# Altium schematic sheet CTRL.SchDoc
size 431 x 279 mm; MPS_ProjectReference: B005; MPS_ProjectName: 230W E-Bike Charger; MPS_Enginieer: Oriol Cos; MPS_Drawn by: -; MPS_Review: v1.2; MPS_SheetNumber: 4; MPS_SheetTotal: 4; MPS_Designed For: Public Reference Design; MPS_Contact: www.monolithicpower.com; Organization: ORGANIZATION; Address1: ADDRESS 1; Address2: ADDRESS 2; Address3: ADDRESS 3; Address4: ADDRESS 4; Revision: -; ENG_APP_DATE: --/--/--; DSN_APP_DATE: --/--/--; CHK_APP_DATE: --/--/--
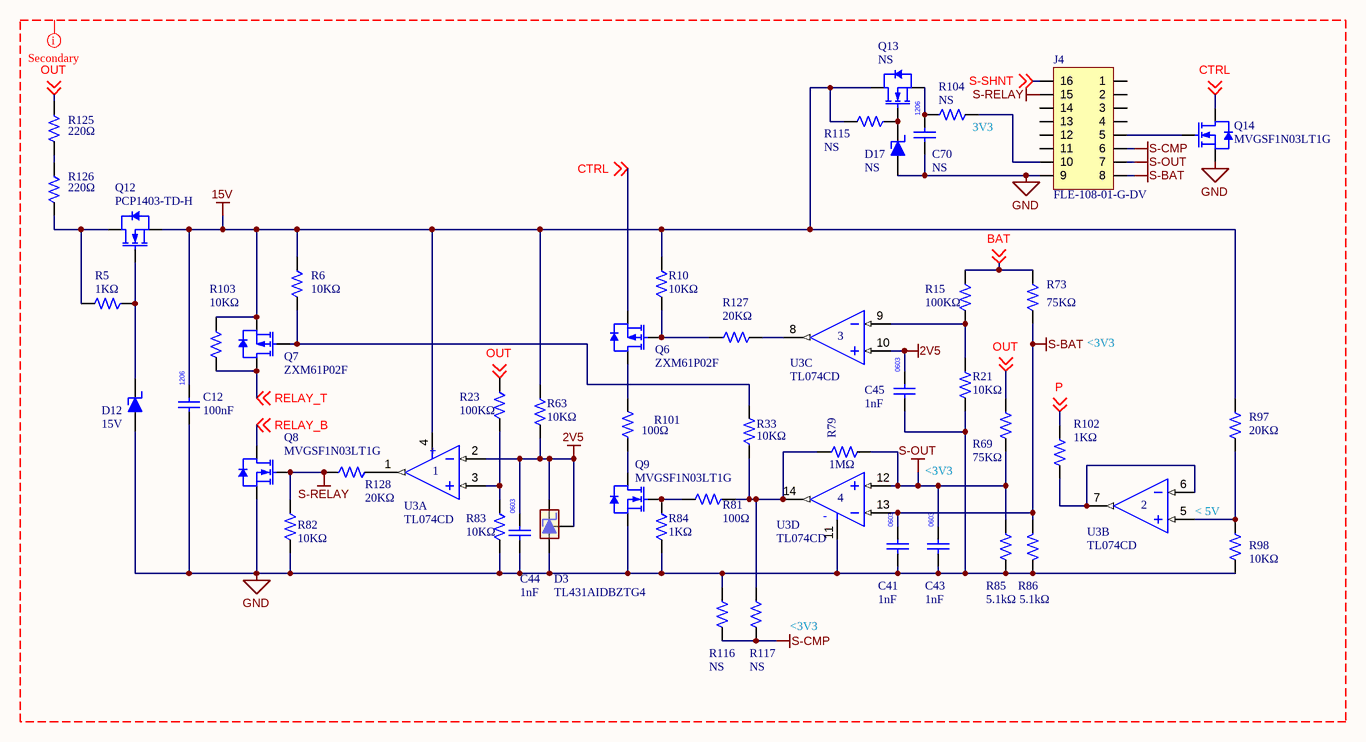
[diagram p0: CTRL.SchDoc]

## Parts
C12  value 100nF  [CC/NM 1206]
C41  value 1nF  [CC/NM 0603]
C43  value 1nF  [CC/NM 0603]
C44  value 1nF  [CC/NM 0603]
C45  value 1nF  [CC/NM 0603]
C70  value NS  [CC/NM 1206]
D3  TL431AIDBZTG4  [SOT95P237X112-3N]
D12  value 15V  [SOT95P237X112-3N]
D17  value NS  [SOT95P237X112-3N]
J4  FLE-108-01-G-DV  [FLE-108-01-G-DV]
Q6  ZXM61P02F  [SOT95P237X112-3N]
Q7  ZXM61P02F  [SOT95P237X112-3N]
Q8  MVGSF1N03LT1G  [SOT95P237X112-3N]
Q9  MVGSF1N03LT1G  [SOT95P237X112-3N]
Q12  PCP1403-TD-H  [SOT89/4]
Q13  Manufacturer Part Number 1: NS  [SOT89/4]  (hidden comment: PCP1403-TD-H)
Q14  MVGSF1N03LT1G  [SOT95P237X112-3N]
R5  value 1KΩ  [CC/NM 0603]
R6  value 10KΩ  [CC/NM 0603]
R10  value 10KΩ  [CC/NM 0603]
R15  value 100KΩ  [CC/NM 0603]  (hidden comment: Resistor 100K)
R21  value 10KΩ  [CC/NM 0603]
R23  value 100KΩ  [CC/NM 0603]  (hidden comment: Resistor 100K)
R33  value 10KΩ  [CC/NM 0603]  (hidden comment: Resistor 100)
R63  value 10KΩ  [CC/NM 0603]
R69  value 75KΩ  [CC/NM 0603]  (hidden comment: Resistor 150K)
R73  value 75KΩ  [CC/NM 0603]  (hidden comment: Resistor 150K)
R79  value 1MΩ  [CC/NM 0603]  (hidden comment: Resistor 150K)
R81  value 100Ω  [CC/NM 0603]  (hidden comment: Resistor 100)
R82  value 10KΩ  [CC/NM 0603]
R83  value 10KΩ  [CC/NM 0603]
R84  value 1KΩ  [CC/NM 0603]
R85  value 5.1kΩ  [CC/NM 0603]
R86  value 5.1kΩ  [CC/NM 0603]
R97  value 20KΩ  [CC/NM 0603]  (hidden comment: Resistor 20K)
R98  value 10KΩ  [CC/NM 0603]  (hidden comment: Resistor 10K)
R101  value 100Ω  [CC/NM 0603]  (hidden comment: Resistor 100)
R102  value 1KΩ  [CC/NM 0603]
R103  value 10KΩ  [CC/NM 0603]
R104  value NS  [CC/NM 0603]  (hidden comment: Resistor 1)
R115  value NS  [CC/NM 0603]
R116  value NS  [CC/NM 0603]  (hidden comment: Resistor 8K2)
R117  value NS  [CC/NM 0603]  (hidden comment: Resistor 30K)
R125  value 220Ω  [CC/NM 1206]  (hidden comment: Resistor 220)
R126  value 220Ω  [CC/NM 1206]  (hidden comment: Resistor 220)
R127  value 20KΩ  [CC/NM 0603]
R128  value 20KΩ  [CC/NM 0603]
U3  TL074CD  [SOIC14]  (parts A,B,C,D of 4)

## Nets
2V5: C44.1 C45.1 D3.1(K) D3.2(REF) R63.2 U3.2(1IN-) U3.10(3IN+)
15V: C12.1 Q7.2(SOURCE) Q12.2(SOURCE) Q13.3(DRAIN) R6.1 R10.1 R63.1 R97.1 R103.1 R115.2 U3.4(VCC)
GND: C12.2 C41.2 C43.2 C44.2 C45.2 C70.2 D3.3(A) D12.1(A) D17.1(A) J4.9 Q8.2(SOURCE) Q9.2(SOURCE) Q14.2(SOURCE) R21.2 R82.2 R83.2 R84.2 R85.2 R86.2 R98.2 R116.1 U3.11(-VCC)
S-BAT: C41.1 J4.8 R73.2 R86.1 U3.13(4IN-)
S-CMP: J4.6 R116.2 R117.2
S-OUT: C43.1 J4.7 R69.2 R79.2 R85.1 U3.12(4IN+)
S-RELAY: J4.15 Q8.1(GATE) R82.1 R128.1
BAT: R15.1 R73.1 ; off-sheet BAT
CTRL: Q6.2(SOURCE) Q14.3(DRAIN) ; off-sheet CTRL
OUT: R23.1 R69.1 R125.1 ; off-sheet OUT
P: R102.1 ; off-sheet P
RELAY_B: Q8.3(DRAIN) ; off-sheet RELAY_B
RELAY_T: Q7.3(DRAIN) R103.2 ; off-sheet RELAY_T
S-SHNT: J4.16 ; off-sheet S-SHNT
NetC70_1: C70.1 Q13.2(SOURCE) R104.1
NetD12_3: D12.3(K) Q12.1(GATE) R5.1
NetD17_3: D17.3(K) Q13.1(GATE) R115.1
NetJ4_5: J4.5 Q14.1(GATE)
NetJ4_10: J4.10 R104.2
NetQ6_1: Q6.1(GATE) R10.2 R127.1
NetQ6_3: Q6.3(DRAIN) R101.2
NetQ7_1: Q7.1(GATE) R6.2 R33.2
NetQ9_1: Q9.1(GATE) R81.2 R84.1
NetQ9_3: Q9.3(DRAIN) R101.1
NetQ12_3: Q12.3(DRAIN) R5.2 R126.2
NetR15_2: R15.2 R21.1 U3.9(3IN-)
NetR23_2: R23.2 R83.1 U3.3(1IN+)
NetR33_1: R33.1 R79.1 R81.1 R117.1 U3.14(4OUT)
NetR97_2: R97.2 R98.1 U3.5(2IN+)
NetR102_2: R102.2 U3.6(2IN-) U3.7(2OUT)
NetR125_2: R125.2 R126.1
NetR127_2: R127.2 U3.8(3OUT)
NetR128_2: R128.2 U3.1(1OUT)

Not connected (* = marked no-connect by the designer): J4 1 2 3 4 11 12 13 14

## Layout directives
net class Secondary: 2V5, 15V, BAT, CTRL, GND, OUT, P, RELAY_B, RELAY_T, S-BAT, S-CMP, S-OUT, S-RELAY, S-SHNT

## Notes on the sheet
- (near R104) 3V3
- <3V3
- < 5V
- (near R117) <3V3
- DWG. NO.
- REV.
- SHT.
- THIS DOCUMENT AND THE DATA DISCLOSED HEREIN OR HEREWITH IS THE PROPERTY OF ALTIUM LIMITED AND MAY BE FREELY DISTRIBUTED IN WHOLE. NO RIGHTS ARE RESERVED OR EXPRESS OR IMPLIED WARANTEE GIVEN.
- REVISION
- DESCRIPTION
- DATE
- APPROVED
- ENG:
- APPROVALS
- PROJECT
- DSN:
- CHK:
- REFERENCE DOCUMENTS
- PROJECT REVISION:
- TITLE
- DOCUMENT REVISION:
- DESIGN ITEM:
- BOM:
- FAB DWG:
- PCB DWG:
- ASSY DWG:
- SCALE:
- SIZE
- B
- CAGE CODE
- FILE NAME
- DWG NO.
- SHEET
- OF
- REV
- (in symbol TL074CD, part A) +
- (in symbol TL074CD, part D) -

## Library data of the parts
C12 = Capacitor 100nF: 100nF; Manufacturer Part Number 1: 1206 100nF; Datasheet: *; Supplier 1: -; Supplier 2: *; Package: 1206; Price 1k Ud.: 0.01; Supplier Part Number 1: -; Manufacturer 1: -
C41 C43-C45 = Capacitor 1nF: 1nF; Manufacturer Part Number 1: 0603 1nF; Datasheet: *; Supplier 1: -; Supplier 2: *; Package: 0603; Price 1k Ud.: 0.01; Supplier Part Number 1: -; Manufacturer 1: -
C70 = Capacitor 100nF: 100nF; Datasheet: *; Supplier 1: *; Supplier 2: *; Package: 1206; Price 1k Ud.: 0.01; Manufacturer Part Number 1: NS
D3 = TL431AIDBZTG4: TL43xx Precision Programmable Reference; Manufacturer 1: TEXAS INSTRUMENTS; Manufacturer Part Number 1: ATL431AIDBZR; Value: 2.495V 1% 36V; Datasheet: http://www.ti.com/lit/ds/symlink/tl431a.pdf; Supplier 1: Farnell; Supplier 2: *; Package: SOT-23-3; Supplier Part Number 1: 3124355
D12 = Zener_18V: Manufacturer 1: ON SEMICONDUCTOR; Manufacturer Part Number 1: BZX84C18LT1G; Datasheet: http://www.farnell.com/datasheets/2236792.pdf?_ga=2.213210964.1976199833.1527489872-1776635558.1522923271&_gac=1.262728446.1526985275.CjwKCAjw_47YBRBxEiwAYuKdww9b6sMrV3bL46mkZpXa3C9ombUFUaiop7L4r4spXLG7BMEaHASa6xoCLfwQAvD_BwE; Package: SOT-23-3; Supplier 1: Farnell; Price 1k Ud.: 0.01; Supplier Part Number 1: 1651579
D17 = Zener_18V: Manufacturer 1: ON SEMICONDUCTOR; Datasheet: http://www.farnell.com/datasheets/2239339.pdf?_ga=2.139736627.1877481321.1537857536-1776635558.1522923271; Package: SOT-23-3; Supplier 1: Farnell; Price 1k Ud.: 0.01; Supplier Part Number 1: 2690054; Manufacturer Part Number 1: NS
J4 = FLE-108-01-G-DV: Manufacturer 1: Samtec; Value: NS; Datasheet: https://www.mouser.es/datasheet/2/527/fle_sm-1369928.pdf; Package: SMD; Supplier 1: Mouser; Supplier Part Number 1: 200-FLE10801GDV; Manufacturer Part Number 1: FLE-108-01-G-DV
Q6 Q7 = ZXM61P02F: PMOS  -20V 0.9A 600 mohm; Manufacturer 1: DIODES INC.; Datasheet: http://www.farnell.com/datasheets/1899048.pdf?_ga=2.230156447.2046274455.1537515722-1776635558.1522923271; Package: SOT-23-3; Supplier 1: Farnell; Value: 20V 0.9A; Supplier Part Number 1: 9525297; Manufacturer Part Number 1: ZXM61P02F
Q8 Q9 = MVGSF1N03LT1G: NMOS 30V 2.1A  80mR; Manufacturer 1: ON SEMICONDUCTOR; Datasheet: http://www.farnell.com/datasheets/1749672.pdf?_ga=2.191310249.2046274455.1537515722-1776635558.1522923271; Package: SOT-23-3; Supplier 1: Farnell; Value: 30V 2.1A; Supplier Part Number 1: 2630354; Manufacturer Part Number 1: MVGSF1N03LT1G
Q12 = PCP1403-TD-H: NMOS 60V 4.5A 117mR; Manufacturer 1: ON SEMICONDUCTOR; Datasheet: https://www.mouser.es/datasheet/2/308/ENA2294-D-336362.pdf; Package: SOT-89-3; Supplier 1: Mouser; Value: 60V 4.5A 117mR; Supplier Part Number 1: 863-PCP1403-TD-H; Manufacturer Part Number 1: PCP1403-TD-H
Q13 = PCP1403-TD-H: NMOS 60V 4.5A 117mR; Manufacturer 1: ON SEMICONDUCTOR; Value: NS; Datasheet: https://www.mouser.es/datasheet/2/308/ENA2294-D-336362.pdf; Package: SOT-89-3; Supplier 1: Mouser; Supplier Part Number 1: 863-PCP1403-TD-H
Q14 = MVGSF1N03LT1G: NMOS 30V 2.1A  80mR; Manufacturer 1: ON SEMICONDUCTOR; Value: NS; Datasheet: http://www.farnell.com/datasheets/1749672.pdf?_ga=2.191310249.2046274455.1537515722-1776635558.1522923271; Package: SOT-23-3; Supplier 1: Farnell; Supplier Part Number 1: 2630354; Manufacturer Part Number 1: NS
R5 = Resistor 1K: Resistor 0603; Manufacturer Part Number 1: 0603 1K; Supplier 1: *; Package: 0603; Datasheet: *; Price 1k Ud.: 0.01
R6 R10 R21 R63 R82 R83 R98 R103 = Resistor 10K: Resistor 0603; Manufacturer Part Number 1: 0603 10K; Supplier 1: *; Package: 0603; Datasheet: *
  R6 R10 R21 R63 R82 R83 R103: Price 1k Ud.: 0.01
R15 R23 = Resistor 100K: Resistor 0603; Manufacturer Part Number 1: 0603 100K; Supplier 1: *; Package: 0603; Datasheet: *
R33 = Resistor 100: Resistor 0603; Manufacturer Part Number 1: 0603 10K; Supplier 1: *; Package: 0603; Datasheet: *; Price 1k Ud.: 0.01
R69 R73 = Resistor 150K: Resistor 0603; Manufacturer Part Number 1: 0603 75K; Supplier 1: *; Package: 0603; Datasheet: *
R79 = Resistor 150K: Resistor 0603; Manufacturer Part Number 1: 0603 1M; Supplier 1: *; Package: 0603; Datasheet: *
R81 R101 = Resistor 100: Resistor 0603; Manufacturer Part Number 1: 0603 100R; Supplier 1: *; Package: 0603; Datasheet: *; Price 1k Ud.: 0.01
R84 R102 = Resistor 10K: Resistor 0603; Manufacturer Part Number 1: 0603 1K; Supplier 1: *; Package: 0603; Datasheet: *; Price 1k Ud.: 0.01
R85 R86 = Resistor 10K: Resistor 0603; Manufacturer Part Number 1: 0603 5K1; Supplier 1: *; Package: 0603; Datasheet: *; Price 1k Ud.: 0.01
R97 = Resistor 20K: Resistor 0603; Manufacturer Part Number 1: 0603 20K; Supplier 1: *; Package: 0603; Datasheet: *
R104 = Resistor 1: Resistor 0603; Supplier 1: *; Package: 0603; Datasheet: *; Manufacturer Part Number 1: NS
R115 = Resistor 1K: Resistor 0603; Supplier 1: *; Package: 0603; Datasheet: *; Price 1k Ud.: 0.01; Manufacturer Part Number 1: NS
R116 = Resistor 8K2: Resistor 0603; Supplier 1: *; Package: 0603; Datasheet: *; Manufacturer Part Number 1: NS
R117 = Resistor 30K: Resistor 0603; Supplier 1: *; Package: 0603; Datasheet: *; Manufacturer Part Number 1: NS
R125 R126 = Resistor 220: Resistor 1206; Manufacturer Part Number 1: 1206 220R; Supplier 1: *; Package: 1206; Datasheet: *
R127 = Resistor 10K: Resistor 0603; Manufacturer Part Number 1: 0603 20K; Supplier 1: *; Package: 0603; Datasheet: *; Price 1k Ud.: 0.01
R128 = Resistor 1K: Resistor 0603; Manufacturer Part Number 1: 0603 20K; Supplier 1: *; Package: 0603; Datasheet: *; Price 1k Ud.: 0.01
U3 = TL074CD: 3 MHz, 13 V/µs, 7V a 36V; Manufacturer 1: TEXAS INSTRUMENTS; Value: 36V 3MHz; Datasheet: http://www.ti.com/lit/ds/symlink/tl074.pdf; Package: SOIC-14; Supplier 1: Farnell; Supplier Part Number 1: 1103010; Manufacturer Part Number 1: TL074CD